# Altium schematic sheet CPU.SchDoc
size A4
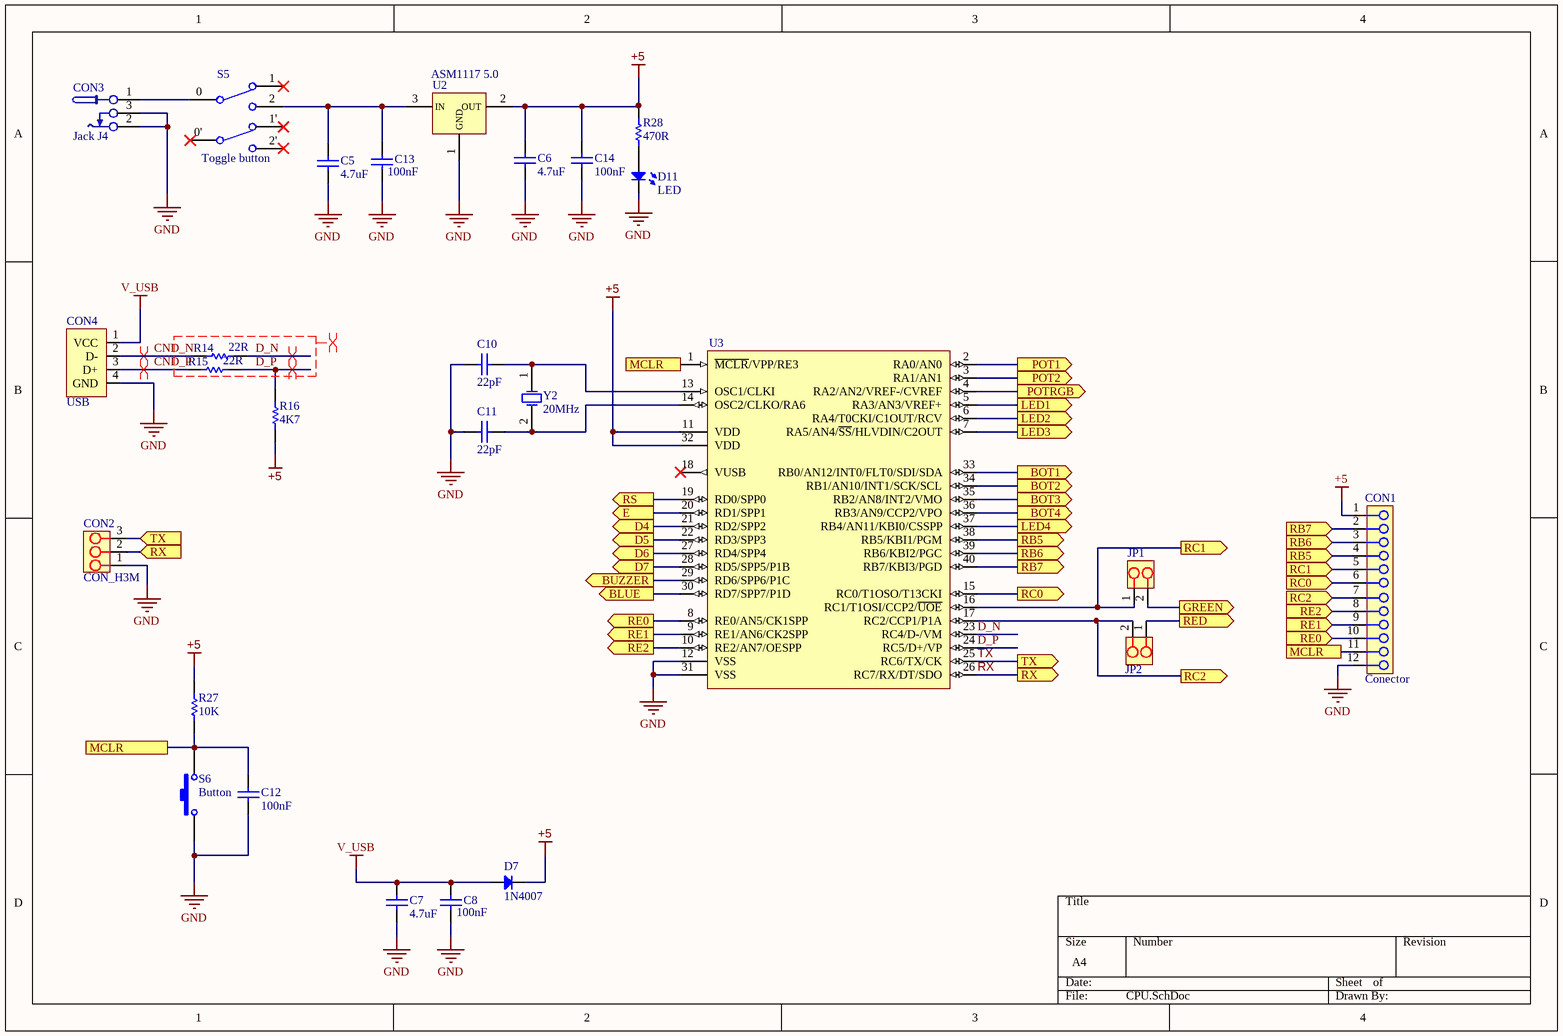
[diagram p0: CPU.SchDoc]

## Parts
C5  4.7uF  [CAP_ELEC_1206]
C6  4.7uF  [CAP_ELEC_1206]
C7  4.7uF  [CC1206]
C8  100nF  [SMD Capacitor]
C10  22pF  [SMD Capacitor]
C11  22pF  [SMD Capacitor]
C12  100nF  [SMD Capacitor]
C13  100nF  [SMD Capacitor]
C14  100nF  [SMD Capacitor]
CON1  Conector  [CON_6x2_M]
CON2  CON_H3M  [CON_3P_M]
CON3  Jack J4  [J4]
CON4  USB  [USB_SMD]
D7  1N4007  [SMA]
D11  LED  [LED_GREEN]
JP1  CON_H2M  [Header2-M]  (value not drawn)
JP2  CON_H2M  [Header2-M]  (value not drawn)
R14  22R  [SMD Resistor]
R15  22R  [SMD Resistor]
R16  4K7  [SMD Resistor]
R27  10K  [SMD Resistor]
R28  470R  [SMD Resistor]
S5  Toggle button  [Toggle button]
S6  Button  [BUTTON]
U2  ASM1117 5.0  [ASM1117 5.0]
U3  PIC18F4550  [DIP40]  (value not drawn)
Y2  20MHz  [CRYSTAL]

## Ports
BLUE (out), BOT1 (out), BOT2 (out), BOT3 (out), BOT4 (out), BUZZER (out), D4 (out), D5 (out), D6 (out), D7 (out), E (out), GREEN (out), LED1 (out), LED2 (out), LED3 (out), LED4 (out), MCLR, POT1 (out), POT2 (out), POTRGB (out), RB5 (in), RB5 (out), RB6 (in), RB6 (out), RB7 (in), RB7 (out), RC0 (in), RC0 (out), RC1 (in), RC1 (out), RC2 (in), RC2 (out), RE0 (in), RE0 (out), RE1 (in), RE1 (out), RE2 (in), RE2 (out), RED (out), RS (out), RX (in), RX (out), TX (in), TX (out)

## Nets
+5: C6.2 C14.2 CON1.1 D7.2(K) R16.1 R27.2 R28.2 U2.2(OUT) U3.11(VDD) U3.32(VDD)
GND: C5.1 C6.1 C7.1 C8.1 C10.1 C11.1 C12.1 C13.1 C14.1 CON1.12 CON2.1 CON3.2 CON3.3 CON4.4(GND) D11.K S6.1 U2.1(GND) U3.12(VSS) U3.31(VSS)
V_USB: C7.2 C8.2 CON4.1(VCC) D7.1(A)
BLUE: U3.30(RD7/SPP7/P1D) ; port BLUE
BOT1: U3.33(RB0/AN12/INT0/FLT0/SDI/SDA) ; port BOT1
BOT2: U3.34(RB1/AN10/INT1/SCK/SCL) ; port BOT2
BOT3: U3.35(RB2/AN8/INT2/VMO) ; port BOT3
BOT4: U3.36(RB3/AN9/CCP2/VPO) ; port BOT4
BUZZER: U3.29(RD6/SPP6/P1C) ; port BUZZER
CND_N: CON4.2(D-) R14.1
CND_P: CON4.3(D+) R15.1
D4: U3.21(RD2/SPP2) ; port D4
D5: U3.22(RD3/SPP3) ; port D5
D6: U3.27(RD4/SPP4) ; port D6
D7: U3.28(RD5/SPP5/P1B) ; port D7
D_N: R14.2 U3.23(RC4/D-/VM)
D_P: R15.2 R16.2 U3.24(RC5/D+/VP)
E: U3.20(RD1/SPP1) ; port E
GREEN: JP1.2 ; port GREEN
LED1: U3.5(RA3/AN3/VREF+) ; port LED1
LED2: U3.6(RA4/T0CKI/C1OUT/RCV) ; port LED2
LED3: U3.7(RA5/AN4/~{SS}/HLVDIN/C2OUT) ; port LED3
LED4: U3.37(RB4/AN11/KBI0/CSSPP) ; port LED4
MCLR: C12.2 CON1.11 R27.1 S6.2 U3.1(~{MCLR}/VPP/RE3) ; port MCLR
POT1: U3.2(RA0/AN0) ; port POT1
POT2: U3.3(RA1/AN1) ; port POT2
POTRGB: U3.4(RA2/AN2/VREF-/CVREF) ; port POTRGB
RB5: CON1.4 U3.38(RB5/KBI1/PGM) ; port RB5
RB6: CON1.3 U3.39(RB6/KBI2/PGC) ; port RB6
RB7: CON1.2 U3.40(RB7/KBI3/PGD) ; port RB7
RC0: CON1.6 U3.15(RC0/T1OSO/T13CKI) ; port RC0
RC1: CON1.5 JP1.1 U3.16(RC1/T1OSI/CCP2/~{UOE}) ; port RC1
RC2: CON1.7 JP2.2 U3.17(RC2/CCP1/P1A) ; port RC2
RE0: CON1.10 U3.8(RE0/AN5/CK1SPP) ; port RE0
RE1: CON1.9 U3.9(RE1/AN6/CK2SPP) ; port RE1
RE2: CON1.8 U3.10(RE2/AN7/OESPP) ; port RE2
RED: JP2.1 ; port RED
RS: U3.19(RD0/SPP0) ; port RS
RX: CON2.2 U3.26(RC7/RX/DT/SDO) ; port RX
TX: CON2.3 U3.25(RC6/TX/CK) ; port TX
NetC5_2: C5.2 C13.2 S5.2 U2.3(IN)
NetC10_2: C10.2 U3.13(OSC1/CLKI) Y2.1(OSC1)
NetC11_2: C11.2 U3.14(OSC2/CLKO/RA6) Y2.2(OSC2)
NetCON3_1: CON3.1 S5.0
NetD11_A: D11.A R28.1

Not connected (* = marked no-connect by the designer): S5 0' 1* 1'* 2'*; U3 18(VUSB)*

## Layout directives
differential pair: CND_N, CND_P, D_N, D_P
net class USB: D_N, D_P

## Library data of the parts
C5 C6 = SMD Eletrolitic Capacitor: Capacitor Cerâmico SMD X7R 50V - 1206
C7 = CC1206: Capacitor ceramica X7R 50V 1206; ComponentLink1Description: Multilayer Ceramic; ComponentLink1URL: https://eu.mouser.com/datasheet/2/212/KEM_C1062_C0G_FT-CAP_SMD-1101746.pdf; Value: 4.7uF
C8 C10-C14 = SMD Capacitor: Multilayer Ceramic / Capacitor 0805; ComponentLink1Description: Multilayer Ceramic; ComponentLink1URL: https://eu.mouser.com/datasheet/2/212/KEM_C1062_C0G_FT-CAP_SMD-1101746.pdf
CON1 = CON_6x2_M
CON2 = CON_H3M: Molex M 3T
CON3 = CON-J4: Conector DC Power Jack J4 2.5mm; Manufacturer: CUI; Manufacturer Part Number: PJ-102BH; Gender: Male; Shielding: Unshielded; Current Rating: 5A; Voltage Rating: 24V; Insulation Resistance: 100MR; Number of Conductors: 2; Supplier 1: Digi-Key; Stock 1: 16445; Pricing 1: 1=0.76, 10=0.708, 25=0.6372, 50=0.5664, 100=0.5428, 250=0.4956, 500=0.472, 1000=0.3894, 2500=0.354 (USD); Mount: Through Hole; Colour: Black; Contact Material: Copper; Contact Plating: Nickel; Housing Colour: Black; Housing Material: Thermoplastic; Min Operating Temperature: -25°C; Max Operating Temperature: 85°C; Package Quantity: 280; Termination: Through Hole; Connector Type: Jack; Contact Gender: Male; Orientation: Horizontal; Packaging: Bulk; Diameter: 2.5mm; Lead Free: Lead Free; Flammability Rating: UL94 V-0; ComponentLink1URL: http://www.mouser.com/ds/2/670/PJ-102BH-524153.pdf; ComponentLink1Description: http://www.mouser.com/ds/2/670/PJ-102BH-524153.pdf; ComponentLink2URL: http://www.cui.com/Product/Resource/FuturePDF/PJ-102BH.pdf; ComponentLink2Description: http://www.cui.com/Product/Resource/FuturePDF/PJ-102BH.pdf; ComponentLink3URL: http://www.cui.com/product/resource/digikeypdf/pj-102bh.pdf; ComponentLink3Description: http://www.cui.com/product/resource/digikeypdf/pj-102bh.pdf; Supplier Part Number 1: CP-102BH-ND
CON4 = Porta_USB_B: Porta USB / tipo B femea
D7 = M7: 1N4007-SMD
D11 = LED-GREEN: Light Emissor Diode - 5mm; Manufacturer: Kingbright; Manufacturer Part Number: WP7113LGD; Colour: Green; Lens Style: Round,Diffused,Tinted; Luminous Intensity: 2mcd; Viewing Angle: 30°; Forward Voltage: 1.9V; Forward Current: 25mA; Dominant Wavelength: 568nm; Test Current: 2mA; Supplier 1: Digi-Key; Stock 1: 193634; Pricing 1: 1=0.48, 10=0.342, 25=0.2624, 100=0.171, 250=0.1254, 500=0.1064, 1000=0.0874, 2500=0.076, 5000=0.0684 (USD); Mount: Through Hole; Case/Package: Radial; Lens Colour: Green; Min Operating Temperature: -40°C; Max Operating Temperature: 85°C; Illumination Colour: Green; Packaging: Bulk; Package Quantity: 1000; Height: 8.6mm; Lead Free: Lead Free; ComponentLink1URL: https://datasheet.ciiva.com/16510/wp7113lgd-16510240.pdf; ComponentLink1Description: https://datasheet.ciiva.com/16510/wp7113lgd-16510240.pdf; ComponentLink2URL: https://datasheet.ciiva.com/4692/wp7113lgd-83708-4692822.pdf; ComponentLink2Description: https://datasheet.ciiva.com/4692/wp7113lgd-83708-4692822.pdf; ComponentLink3URL: https://datasheet.ciiva.com/14604/70062982-14604412.pdf; ComponentLink3Description: https://datasheet.ciiva.com/14604/70062982-14604412.pdf; ComponentLink4URL: https://datasheet.ciiva.com/2114/wp7113lgd-2114397.pdf; ComponentLink4Description: https://datasheet.ciiva.com/2114/wp7113lgd-2114397.pdf; Supplier Part Number 1: 754-1265-ND
JP1 JP2 = CON_H2M: Molex M 2T; Manufacturer: Harwin; Manufacturer Part Number: M20-9990246; Contact Resistance: 30mR; Max Current Rating: 3A; Number of Positions: 2; Gender: Male; Connector Type: Male Pin; Insulation Resistance: 10GR; Voltage Rating (AC): 750V; Pitch: 2.54mm; Supplier 1: Digi-Key; Stock 1: 53821; Pricing 1: 1=0.11, 10=0.099, 100=0.0609, 500=0.0504, 1000=0.0441, 5000=0.0378, 10000=0.0368 (USD); Mount: Through Hole; Case/Package: SIL; Colour: Black; Housing Colour: Black; Housing Material: Nylon; Contact Plating: Tin; Contact Material: Bronze,Brass; Min Operating Temperature: -40°C; Max Operating Temperature: 105°C; Package Quantity: 1000; Packaging: Bulk; Termination: Solder; Number of Rows: 1; Number of Contacts: 2; Orientation: Straight; Current Rating: 3A; Length: 5.08mm; Depth: 2.54mm; Contact Mating Length: 0.24inch; Radiation Hardening: No; REACH SVHC: No SVHC; ComponentLink1URL: https://datasheet.ciiva.com/8046/315376-8046930.pdf; ComponentLink1Description: https://datasheet.ciiva.com/8046/315376-8046930.pdf; ComponentLink2URL: https://datasheet.ciiva.com/6833/m20-999-6833368.pdf; ComponentLink2Description: https://datasheet.ciiva.com/6833/m20-999-6833368.pdf; ComponentLink3URL: https://datasheet.ciiva.com/11745/0900766b81034e61-11745755.pdf; ComponentLink3Description: https://datasheet.ciiva.com/11745/0900766b81034e61-11745755.pdf; ComponentLink4URL: https://datasheet.ciiva.com/22660/1830818-22660571.pdf; ComponentLink4Description: https://datasheet.ciiva.com/22660/1830818-22660571.pdf; ComponentLink5URL: https://datasheet.ciiva.com/26852/getdatasheetpartid-384170-26852203.pdf; ComponentLink5Description: https://datasheet.ciiva.com/26852/getdatasheetpartid-384170-26852203.pdf; Supplier Part Number 1: 952-2262-ND
R14-R16 R27 R28 = SMD Resistor: SMD Resistor  MCU 0805
S6 = Button: Tactil Switch; Manufacturer: Panasonic; Manufacturer Part Number: EVQ-PAC07K; Mechanical Life: 100000Cycles; Max Current Rating: 20mA; Operating Force: 1N; Throw Configuration: SPST; Voltage Rating (DC): 15V; Contact Resistance: 50mR; Illumination Type: Non-Illuminated,Illuminated; Switch Travel: 0.25mm; Switch Function: Off-Mom; Actuator Length: 3.1mm; Size: 6x6x5mm; Supplier 1: Digi-Key; Stock 1: 36840; Pricing 1: 1=0.2, 10=0.196, 25=0.1896, 50=0.1828, 100=0.1726, 250=0.1625, 500=0.1557, 1000=0.1185, 5000=0.0982 (USD); Mount: Through Hole; Colour: Black; Contact Plating: Gold,Silver; Min Operating Temperature: -20°C; Max Operating Temperature: 70°C; Packaging: Bulk; Max Voltage Rating (DC): 15V; Current Rating: 20mA; Package Quantity: 500; Termination: PC Pins; Electrical Life: 100000Cycles; Contact Current Rating: 20mA; Orientation: Straight; Length: 6mm; Height: 7mm; Width: 6mm; Depth: 7.8mm; Radiation Hardening: No; REACH SVHC: Unknown; Lead Free: Lead Free; ComponentLink1URL: https://datasheet.ciiva.com/17027/70270700-17027701.pdf; ComponentLink1Description: https://datasheet.ciiva.com/17027/70270700-17027701.pdf; ComponentLink2URL: https://datasheet.ciiva.com/15184/getdatasheetpartid-174669-15184695.pdf; ComponentLink2Description: https://datasheet.ciiva.com/15184/getdatasheetpartid-174669-15184695.pdf; ComponentLink3URL: https://datasheet.ciiva.com/8166/atk0000ce10-8166344.pdf; ComponentLink3Description: https://datasheet.ciiva.com/8166/atk0000ce10-8166344.pdf; ComponentLink4URL: https://datasheet.ciiva.com/30262/36atk0000ce10-30262264.pdf; ComponentLink4Description: https://datasheet.ciiva.com/30262/36atk0000ce10-30262264.pdf; ComponentLink5URL: https://datasheet.ciiva.com/16695/atk0000ce10-16695929.pdf; ComponentLink5Description: https://datasheet.ciiva.com/16695/atk0000ce10-16695929.pdf; ComponentLink6URL: https://datasheet.ciiva.com/24076/atk0000ce10-33274-24076314.pdf; ComponentLink6Description: https://datasheet.ciiva.com/24076/atk0000ce10-33274-24076314.pdf; ComponentLink7URL: https://datasheet.ciiva.com/7645/atk0000ce10-7645644.pdf; ComponentLink7Description: https://datasheet.ciiva.com/7645/atk0000ce10-7645644.pdf; ComponentLink8URL: https://datasheet.ciiva.com/2899/atk0000ce10-2899661.pdf; ComponentLink8Description: https://datasheet.ciiva.com/2899/atk0000ce10-2899661.pdf; Supplier Part Number 1: P8011S-ND
U2 = ASM1117 5.0: LOW DROPOUT VOLTAGE REGULATOR; ComponentLink1Description: ASM1117 5.0; ComponentLink1URL: https://pdf1.alldatasheet.com/datasheet-pdf/view/1137421/ARTSCHIP/AMS1117-1.5.html
U3 = PIC18F4550: High Performance, Enhanced Flash, USB Microcontroller with nanoWatt Technology, 32K Flash, 40-Pin PDIP, Industrial Temperature Range; Manufacturer: Microchip; Manufacturer Part Number: PIC18F4550-I/P; Interface: I2C,SPI,USB,UART,USART; Data Bus Width: 8b; Number of Bits: 8; Core Architecture: PIC; Max Power Dissipation: 1W; Number of I/Os: 35; Number of Timers/Counters: 4; RAM Size: 2KB; Max Supply Voltage: 5.5V; Min Supply Voltage: 4.2V; Number of ADC Channels: 13; Number of PWM Channels: 5; Frequency: 48MHz; Density: 32KB; Number of UART Channels: 1; Oscillator Type: Internal; Watchdog Timer: Yes; Nominal Supply Current: 1.1mA; Access Time: 48us; Peripherals: Brown-out Detect/Reset,POR,PWM,WDT,HLVD,I2C; Supplier 1: Digi-Key; Stock 1: 666; Pricing 1: 1=4.6, 25=4.4908, 100=4.3878 (USD); Mount: Through Hole; Case/Package: PDIP; Number of Pins: 40; Weight: 0.05lb; Min Operating Temperature: -40°C; Max Operating Temperature: 85°C; Package Quantity: 10; Packaging: Rail/Tube; Number of Programmable I/O: 35; Max Frequency: 48MHz; Number of SPI Channels: 1; Number of I2C Channels: 1; Memory Type: FLASH; Number of A/D Converters: 1; Address Bus Width: 8b; Memory Size: 32KB; Length: 53.21mm; Height: 0.195inch; Width: 0.58inch; Radiation Hardening: No; Lead Free: Lead Free; REACH SVHC: No SVHC; ComponentLink1URL: https://datasheet.ciiva.com/19471/2177678-19471492.pdf; ComponentLink1Description: https://datasheet.ciiva.com/19471/2177678-19471492.pdf; ComponentLink2URL: https://datasheet.ciiva.com/16362/filehandler-aspxddocname-en020587-16362390.pdf; ComponentLink2Description: https://datasheet.ciiva.com/16362/filehandler-aspxddocname-en020587-16362390.pdf; ComponentLink3URL: https://datasheet.ciiva.com/1494/39632e-1494503.pdf; ComponentLink3Description: https://datasheet.ciiva.com/1494/39632e-1494503.pdf; ComponentLink4URL: https://datasheet.ciiva.com/9244/39632d-9244680.pdf; ComponentLink4Description: https://datasheet.ciiva.com/9244/39632d-9244680.pdf; ComponentLink5URL: https://datasheet.ciiva.com/7181/720550-7181018.pdf; ComponentLink5Description: https://datasheet.ciiva.com/7181/720550-7181018.pdf; ComponentLink6URL: https://datasheet.ciiva.com/18404/70045698-18404428.pdf; ComponentLink6Description: https://datasheet.ciiva.com/18404/70045698-18404428.pdf; ComponentLink7URL: https://datasheet.ciiva.com/17992/pic18f4550-17992030.pdf; ComponentLink7Description: https://datasheet.ciiva.com/17992/pic18f4550-17992030.pdf; ComponentLink8URL: https://datasheet.ciiva.com/29330/651708-da-01-en-ic-pic-mcu-pic18f4550-i-p-dip-40-mcp-29330715.pdf; ComponentLink8Description: https://datasheet.ciiva.com/29330/651708-da-01-en-ic-pic-mcu-pic18f4550-i-p-dip-40-mcp-29330715.pdf; ComponentLink9URL: https://datasheet.ciiva.com/26816/pic18f4550-i-p-26816637.pdf; ComponentLink9Description: https://datasheet.ciiva.com/26816/pic18f4550-i-p-26816637.pdf; Supplier Part Number 1: PIC18F4550-I/P-ND
Y2 = Crystal_Oscillator: Quartz Crystal; Manufacturer: ECS International; Manufacturer Part Number: ECS-200-18-4XEN; Frequency Tolerance: 30ppm; Load Capacitance: 18pF; ESR (Equivalent Series Resistance): 30R; Frequency Stability: 50ppm; Supplier 1: Digi-Key; Stock 1: 3788; Pricing 1: 1=0.66, 10=0.55, 50=0.495, 100=0.44, 500=0.418, 1000=0.352, 2500=0.33, 5000=0.319, 10000=0.308 (USD); Mount: Through Hole; Min Operating Temperature: -40°C; Max Operating Temperature: 85°C; Package Quantity: 200; Frequency: 20MHz; Packaging: Bulk; Tolerance: 30ppm; Termination: Radial; Length: 0.447inch; Height: 0.138inch; Width: 0.183inch; ComponentLink1URL: https://datasheet.ciiva.com/853/hc-49usx-853271.pdf; ComponentLink1Description: https://datasheet.ciiva.com/853/hc-49usx-853271.pdf; Supplier Part Number 1: XC1723-ND
S5 = Toggle button: ComponentLink1Description: datasheet; ComponentLink1URL: https://dznh3ojzb2azq.cloudfront.net/products/Keyswitch/PVA/documents/datasheet.pdf; ComponentLink2Description: buy; ComponentLink2URL: https://www.alibaba.com/product-detail/Latching-7x7mm-Mini-Tactile-Push-Button_60227167979.html